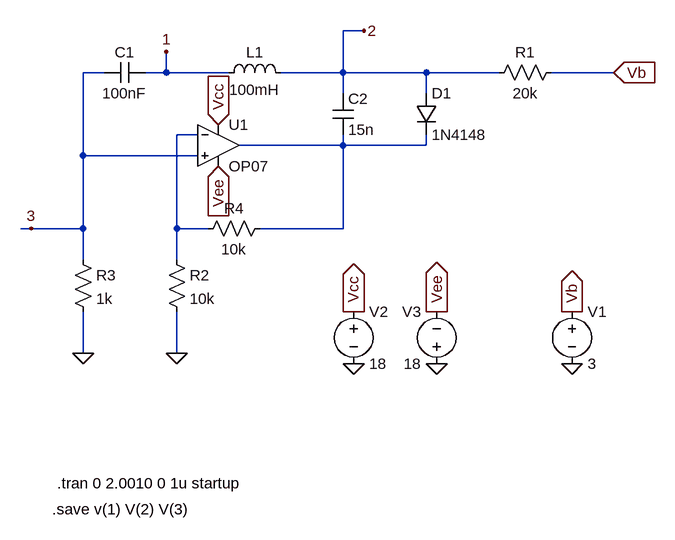
[diagram p0: schematic V_TX.asc]
V_TX.asc, the LTspice schematic file:
Version 4
SHEET 1 1596 1032
WIRE -272 -288 -304 -288
WIRE -672 -224 -704 -224
WIRE -576 -224 -576 -256
WIRE -576 -224 -608 -224
WIRE -480 -224 -576 -224
WIRE -304 -224 -304 -288
WIRE -304 -224 -400 -224
WIRE -176 -224 -304 -224
WIRE -64 -224 -176 -224
WIRE 112 -224 16 -224
WIRE -304 -192 -304 -224
WIRE -176 -192 -176 -224
WIRE -528 -128 -560 -128
WIRE -304 -112 -304 -128
WIRE -304 -112 -464 -112
WIRE -176 -112 -176 -128
WIRE -176 -112 -304 -112
WIRE -704 -96 -704 -224
WIRE -528 -96 -704 -96
WIRE -784 16 -800 16
WIRE -704 16 -704 -96
WIRE -704 16 -784 16
WIRE -560 16 -560 -128
WIRE -512 16 -560 16
WIRE -304 16 -304 -112
WIRE -304 16 -432 16
WIRE -704 64 -704 16
WIRE -560 64 -560 16
WIRE -704 208 -704 144
WIRE -560 208 -560 144
FLAG -704 208 0
FLAG -560 208 0
FLAG 48 224 0
FLAG 48 144 Vb
IOPIN 48 144 Out
FLAG 112 -224 Vb
IOPIN 112 -224 In
FLAG -288 224 0
FLAG -160 224 0
FLAG -288 144 Vcc
IOPIN -288 144 Out
FLAG -496 -144 Vcc
IOPIN -496 -144 In
FLAG -160 144 Vee
IOPIN -160 144 Out
FLAG -496 -80 Vee
IOPIN -496 -80 In
FLAG -576 -256 1
FLAG -272 -288 2
FLAG -784 16 3
SYMBOL cap -672 -208 R270
WINDOW 0 32 32 VTop 2
WINDOW 3 0 32 VBottom 2
SYMATTR InstName C1
SYMATTR Value 100nF
SYMBOL ind -496 -208 R270
WINDOW 0 32 56 VTop 2
WINDOW 3 5 56 VBottom 2
SYMATTR InstName L1
SYMATTR Value 100mH
SYMBOL res 32 -240 R90
WINDOW 0 0 56 VBottom 2
WINDOW 3 32 56 VTop 2
SYMATTR InstName R1
SYMATTR Value 20k
SYMBOL cap -320 -192 R0
SYMATTR InstName C2
SYMATTR Value 15n
SYMBOL diode -192 -192 R0
SYMATTR InstName D1
SYMATTR Value 1N4148
SYMBOL res -576 48 R0
SYMATTR InstName R2
SYMATTR Value 10k
SYMBOL res -720 48 R0
SYMATTR InstName R3
SYMATTR Value 1k
SYMBOL res -416 0 R90
WINDOW 0 0 56 VBottom 2
WINDOW 3 32 56 VTop 2
SYMATTR InstName R4
SYMATTR Value 10k
SYMBOL voltage 48 128 R0
WINDOW 123 0 0 Left 0
WINDOW 39 0 0 Left 0
SYMATTR InstName V1
SYMATTR Value 3
SYMBOL voltage -288 128 R0
WINDOW 123 0 0 Left 0
WINDOW 39 0 0 Left 0
SYMATTR InstName V2
SYMATTR Value 18
SYMBOL voltage -160 240 R180
WINDOW 0 24 96 Left 2
WINDOW 3 24 16 Left 2
WINDOW 123 0 0 Left 0
WINDOW 39 0 0 Left 0
SYMATTR InstName V3
SYMATTR Value 18
SYMBOL Opamps\\OP07 -496 -176 R0
SYMATTR InstName U1
TEXT -744 408 Left 2 !.tran 0 2.0010 0 1u startup
TEXT -752 448 Left 2 !.save v(1) V(2) V(3)

The netlist it stands for:
* V_TX.asc
C1 3 1 100nF
L1 1 2 100mH
R1 Vb 2 20k
C2 2 N002 15n
D1 2 N002 1N4148
R2 N001 0 10k
R3 3 0 1k
R4 N002 N001 10k
V1 Vb 0 3
V2 Vcc 0 18
V3 0 Vee 18
XU1 3 N001 Vcc Vee N002 LT1001  ; OP07, pins In+ In- V+ V- OUT
.model D D
.lib standard.dio
.tran 0 2.0010 0 1u startup
.save v(1) V(2) V(3)
.lib LTC.lib
.backanno
.end